# Altium schematic sheet BAI4.SchDoc
size A; SheetNumber: 1; SheetTotal: 1
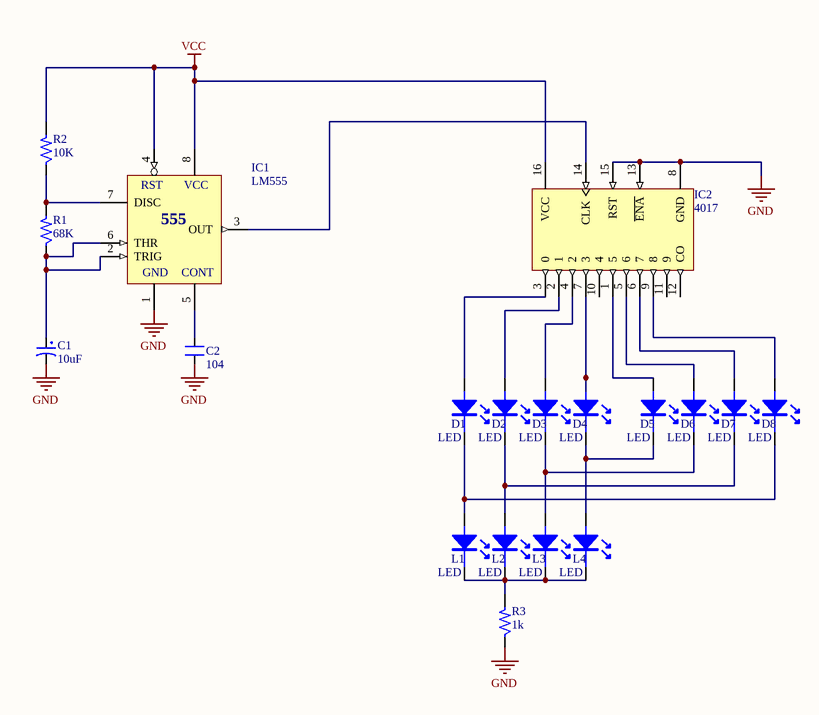
[diagram p0: BAI4.SchDoc]

## Parts
C1  10uF  [CP1/2]
C2  104  [SM-0805]
D1  LED  [CAP10UF]
D2  LED  [CAP10UF]
D3  LED  [CAP10UF]
D4  LED  [CAP10UF]
D5  LED  [CAP10UF]
D6  LED  [CAP10UF]
D7  LED  [CAP10UF]
D8  LED  [CAP10UF]
IC1  LM555  [DIP8]
IC2  4017  [DIP16]
L1  LED  [CAP10UF]
L2  LED  [CAP10UF]
L3  LED  [CAP10UF]
L4  LED  [CAP10UF]
R1  68K  [R1/6W]
R2  10K  [R1/6W]
R3  1k  [R1/6W]

## Nets
GND: C1.2 C2.1 IC1.1(GND) IC2.8(GND) IC2.13(~{ENA}) IC2.15(RST) R3.1
VCC: IC1.4(RST) IC1.8(VCC) IC2.16(VCC) R2.2
NetC1_1: C1.1 IC1.2(TRIG) IC1.6(THR) R1.1
NetC2_2: C2.2 IC1.5(CONT)
NetD1_1: D1.1 IC2.3(0)
NetD1_2: D1.2 D8.2 L1.1
NetD2_1: D2.1 IC2.2(1)
NetD2_2: D2.2 D7.2 L2.1
NetD3_1: D3.1 IC2.4(2)
NetD3_2: D3.2 D6.2 L3.1
NetD4_1: D4.1 IC2.7(3)
NetD4_2: D4.2 D5.2 L4.1
NetD5_1: D5.1 IC2.1(5)
NetD6_1: D6.1 IC2.5(6)
NetD7_1: D7.1 IC2.6(7)
NetD8_1: D8.1 IC2.9(8)
NetIC1_3: IC1.3(OUT) IC2.14(CLK)
NetIC1_7: IC1.7(DISC) R1.2 R2.1
NetL1_2: L1.2 L2.2 L3.2 L4.2 R3.2

Not connected (* = marked no-connect by the designer): IC2 10(4) 11(9) 12(CO)

## Notes on the sheet
- (in symbol LM555) 555

## Library data of the parts
C1 = CP1: Cap P  0,1uF < 22uF , 16 - 50V; Value: 10uF/50V; Description 1: 10 => 220uF/6,3V/10V - 10uF => 100uF/16V; Description 2: 0,1uF => 33uF/50V - 10uF => 22uF/63V; Description 3: 0,47uF => 10uF/100V
C2 = CM: Cap SMD; Value: 103
IC1 = LM555: Timer Circuits; Value: LM555
IC2 = 4017: Decade Counter/Divider with 10 Decoded Outputs; Designed by: VanDungEvn; Value: CD4017
R1-R3 = Res: Resistor 1/4W; Value: R1/4W - 1K